# Altium schematic sheet Power_Board.SchDoc
size A; SheetNumber: 2; SheetTotal: 3
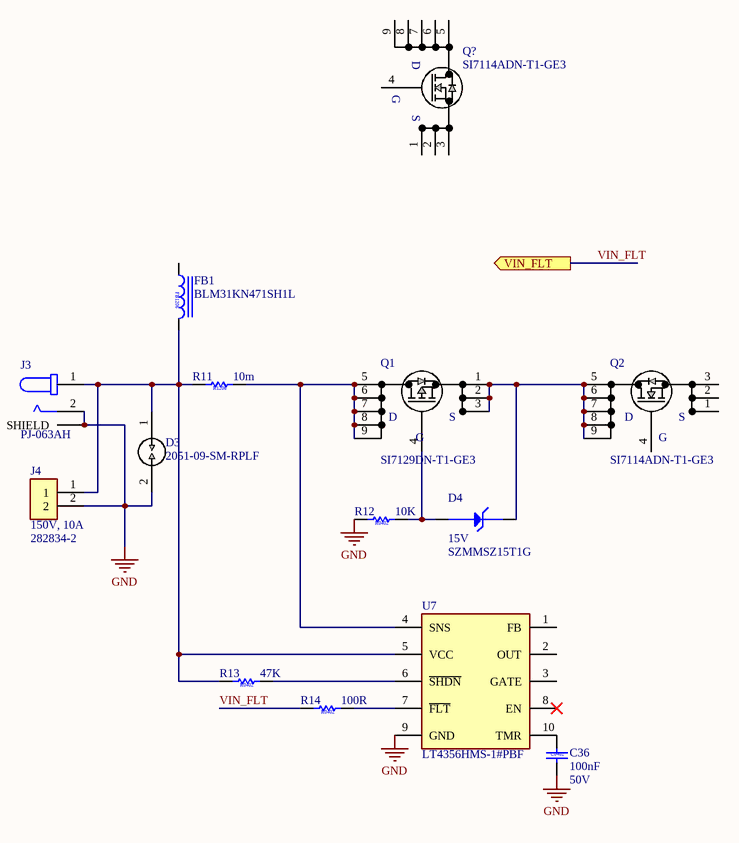
[diagram p0: Power_Board.SchDoc]

## Parts
C36  value 100nF  Voltage_Rating: 50V  [C0402]  (hidden comment: GRM155R71H104KE14D)
D3  2051-09-SM-RPLF  [DIO_GAS_205109SMRPLF]
D4  SZMMSZ15T1G  value 15V  [DIO_ZEN_SOD3716X135N]
FB1  BLM31KN471SH1L  [FB1206]
J3  PJ-063AH  [CON_CUI_PJ-063AH]
J4  282834-2  value 150V, 10A  [CON_TE_282834-2]
Q1  SI7129DN-T1-GE3  [MOS_POWERPACK-1212-8]
Q2  SI7114ADN-T1-GE3  [MOS_POWERPACK-1212-8]
Q?  SI7114ADN-T1-GE3  [MOS_POWERPACK-1212-8]
R11  value 10m  [R1206]  (hidden comment: PA1206FRE470R01Z)
R12  value 10K  [R0402]  (hidden comment: RC0402FR-0710KL)
R13  value 47K  [R0402]  (hidden comment: RC0402FR-0747KL)
R14  value 100R  [R0402]  (hidden comment: RC0402FR-07100RL)
U7  LT4356HMS-1#PBF  [SPD_SOP50P490X110-10N]

## Ports
VIN_FLT (out)

## Nets
GND: C36.1 D3.2 J3.2 J3.S1(SHIELD) J3.S2(SHIELD) J4.2 R12.1 U7.9(GND)
VIN_FLT: R14.1 ; port VIN_FLT
NetC36_2: C36.2 U7.10(TMR)
NetD3_1: D3.1 FB1.2 J3.1 J4.1 R11.1 R13.1 U7.5(VCC)
NetD4_1: D4.1(IO1) Q1.1(S) Q1.2(S) Q1.3(S) Q2.5(D) Q2.6(D) Q2.7(D) Q2.8(D) Q2.9(D)
NetD4_2: D4.2(GND) Q1.4(G) R12.2
NetQ1_5: Q1.5(D) Q1.6(D) Q1.7(D) Q1.8(D) Q1.9(D) R11.2 U7.4(SNS)
NetR13_2: R13.2 U7.6(~{SHDN})
NetR14_2: R14.2 U7.7(~{FLT})

Not connected (* = marked no-connect by the designer): FB1 1; Q2 1(S) 2(S) 3(S) 4(G); Q? 1(S) 2(S) 3(S) 4(G) 5(D) 6(D) 7(D) 8(D) 9(D); U7 1(FB) 2(OUT) 3(GATE) 8(EN)*

## Notes on the sheet
- (in symbol IND-203) FB1206

## Library data of the parts
C36 = CAP-104: Capacitor, MLCC, 100nF, 50V, X7R, 10%, 0402, T=0.5mm; Manufacturer: MURATA; Catalog_Number: 821614902; Part_Type: Capacitor; Manufacturer_Part_Number: GRM155R71H104KE14D; Package: C0402; ComponentLink1Description: Datasheet; ComponentLink1URL: http://tunmcdsvn.tun.st.com/Component_Datasheet_Library/Trunk/Capacitors/Murata_Capacitor_GR_series; Price(ILS): 0.1
D3 = DIO-201: Gas Discharge Tube, 90V DC Sparkover, 2kA Peak Pulse Current; Manufacturer: Bourns; Part_Type: Diode; Catalog_Number: 821200342; Datasheet Link: https://datasheet.datasheetarchive.com/originals/distributors/Datasheets-DGA18/380742.pdf; Manufacturer_Part_Number: 2051-09-SM-RPLF; Mouser Part Number: 652-2051-09-SM-RPLF; Mouser Price/Stock: https://www.mouser.co.uk/ProductDetail/Bourns/2051-09-SM-RPLF?qs=oyIm%2F3giSj7NHFY1d4mMJA%3D%3D; Arrow Part Number: 2051-09-SM-RPLF; Arrow Price/Stock: https://www.arrow.com/en/products/2051-09-sm-rplf/bourns?region=nac; Price(ILS): 3.08
D4 = DIO-001: Diode, Zener, 15V, 500mW, Low Current for Voltage Regulator; Manufacturer: onsemi; Catalog_Number: 821615283; Datasheet Link: chrome-extension://efaidnbmnnnibpcajpcglclefindmkaj/https://www.mouser.co.il/datasheet/2/308/1/MMSZ2V4T1_D-2316151.pdf; Manufacturer_Part_Number: SZMMSZ15T1G; Mouser Part Number: 863-SZMMSZ15T1G; Mouser Price/Stock: https://www.mouser.co.il/ProductDetail/onsemi/SZMMSZ15T1G?qs=PJJcWtbOkNXOKlSj9GlfUQ%3D%3D; Part_Type: Diode; Price(ILS): 1.72
FB1 = IND-203: Ferrite bead, 470R@100MHz, 4A, 20mOhm DCR, 25%, 1206; Manufacturer: MURATA; Catalog_Number: 821614210; Mouser Part Number: 81-BLM31KN471SH1L; Mouser Price/Stock: https://www.mouser.co.il/ProductDetail/Murata-Electronics/BLM31KN471SH1L?qs=EU6FO9ffTwc7C8y3YWE9tQ%3D%3D; Manufacturer_Part_Number: BLM31KN471SH1L; Datasheet Link: https://www.mouser.co.il/datasheet/2/281/QNFA9148-1915696.pdf; Part_Type: Ferrite bead; Value: 470R@100MHz; Price(ILS): 0.3
J3 = CON-005: Connector, Power Barrel Connector Jack, 2.10mm ID (0.083"), 5.50mm OD (0.217"), 24V, 8A, Through Hole, Right Angle; Manufacturer: CUI Devices; Catalog_Number: 821615011; Mouser Price/Stock: https://www.mouser.co.il/ProductDetail/CUI-Devices/PJ-063AH?qs=WyjlAZoYn51bQfA53nMcVA%3D%3D; Mouser Part Number: 490-PJ-063AH; Datasheet Link: https://www.cuidevices.com/product/product-resources/pj-063ah.pdf; Voltage Rating: 24V; Current Rating: 8A; Part_Type: Connector; Manufacturer_Part_Number: PJ-063AH; Price(ILS): 5.58
J4 = CON-201: Connector, Fixed Terminal Block, 2 Position, 2.54mm, .100" pitch, Through All, 150V, 10A, 16-30 AWG, Screw Connection; Manufacturer: TE Connectivity; Catalog_Number: 821615402; Datasheet Link: https://www.te.com/commerce/DocumentDelivery/DDEController?Action=showdoc&DocId=Catalog+Section%7F1308389_EUROSTYLE_TERMINAL_BLOCKS%7F0607%7Fpdf%7FEnglish%7FENG_CS_1308389_EUROSTYLE_TERMINAL_BLOCKS_0607.pdf%7F282834-2; Manufacturer_Part_Number: 282834-2; Mouser Part Number: 571-282834-2; Mouser Price/Stock: https://www.mouser.co.il/ProductDetail/TE-Connectivity/282834-2?qs=A%252Bip%252BNCYi6N8cVKuk8xDog%3D%3D; Part_Type: Connector; Price(ILS): 4.59
Q1 = TRA-002: MOSFET P-Channel, 1.5-2.8V Vth, 35A, 20mOhm Rds, -30V Vds, -20V Vgs, PowerPAK 1212-8; Manufacturer: Vishay; Catalog_Number: 821603170; Datasheet Link: https://www.vishay.com/docs/68966/si7129dn.pdf; Manufacturer_Part_Number: SI7129DN-T1-GE3; Mouser Part Number: 781-SI7129DN-GE3; Mouser Price/Stock: https://www.mouser.co.il/ProductDetail/Vishay-Semiconductors/SI7129DN-T1-GE3?qs=LWWr1WFOkdGr29jiBIQirw%3D%3D; Arrow Part Number: SI7129DN-T1-GE3; Arrow Price/Stock: https://www.arrow.com/en/products/si7129dn-t1-ge3/vishay?region=nac; Part_Type: MOSFET; Price(ILS): 3.36
Q2 Q? = TRA-001: MOSFET N-Channel, 1.2-2.5V Vth, 35A, 9.8mOhm Rds, 30V Vds, 20V Vgs, PowerPAK 1212-8; Manufacturer: Vishay; Catalog_Number: 821603234; Datasheet Link: https://www.vishay.com/docs/68932/si7114ad.pdf; Manufacturer_Part_Number: SI7114ADN-T1-GE3; Mouser Part Number: 781-SI7114ADN-T1-GE3; Mouser Price/Stock: https://www.mouser.co.il/ProductDetail/Vishay-Semiconductors/SI7114ADN-T1-GE3?qs=cPOO8qjhL6Mzxqw2gJeXWA%3D%3D; Arrow Part Number: SI7114DAN-T1-GE3; Arrow Price/Stock: https://www.arrow.com/en/products/si7114adn-t1-ge3/vishay?region=nac; Part_Type: MOSFET; Price(ILS): 3.73
R11 = RES-401: Resistor,10m,1206,1%,1W; Manufacturer: YAGEO; Alternate_Part_Number: WSLP1206R0100FEA; Alternate_Manufacturer: Vishay; Catalog_Number: 821615240; Part_Type: Resistor; Manufacturer_Part_Number: PA1206FRE470R01Z; Package: R1206; ComponentLink1Description: Datasheet; ComponentLink1URL: http://tunmcdsvn.tun.st.com/Component_Datasheet_Library/Trunk/Resistors/Yageo_Resistor_RC0402-series; Price(ILS): 0.1
R12 = RES-007: Resistor,10K,0402,1%,1/16W; Manufacturer: YAGEO; Catalog_Number: 800746930; Part_Type: Resistor; Manufacturer_Part_Number: RC0402FR-0710KL; Package: R0402; ComponentLink1Description: Datasheet; ComponentLink1URL: http://tunmcdsvn.tun.st.com/Component_Datasheet_Library/Trunk/Resistors/Yageo_Resistor_RC0402-series; Price(ILS): 0.1
R13 = RES-011: Resistor,47K,0402,1%,1/16W; Manufacturer: YAGEO; Catalog_Number: 821615186; Manufacturer_Part_Number: RC0402FR-0747KL; ComponentLink1Description: Datasheet; Part_Type: Resistor; Package: R0402; ComponentLink1URL: http://tunmcdsvn.tun.st.com/Component_Datasheet_Library/Trunk/Resistors/Yageo_Resistor_RC0402-series; Price(ILS): 0.1
R14 = RES-106: Resistor,100R,0402,1%,1/16W; Manufacturer: YAGEO; Catalog_Number: 988943207; Provided_By: SUBCO; Part_Type: Resistor; Manufacturer_Part_Number: RC0402FR-07100RL; ComponentLink1Description: Datasheet; Package: R0402; ComponentLink1URL: http://tunmcdsvn.tun.st.com/Component_Datasheet_Library/Trunk/Resistors/Yageo_Resistor_RC0402-series; Price(ILS): 0.1
U7 = ICS-112: SPD, Surge Suppressor, 4 VDC to 80 VDC, 40 uA; Manufacturer: Analog Devices; Catalog_Number: 821615429; Datasheet Link: chrome-extension://efaidnbmnnnibpcajpcglclefindmkaj/https://www.mouser.co.il/datasheet/2/609/LT4356_1_4356_2-1269492.pdf; Manufacturer_Part_Number: LT4356HMS-1#PBF; Mouser Part Number: 584-LT4356HMS-1#PBF; Mouser Price/Stock: https://www.mouser.co.il/ProductDetail/Analog-Devices/LT4356HMS-1PBF?qs=hVkxg5c3xu8TVCfpfkiVjw%3D%3D; Arrow Part Number: LT4356HMS-1#PBF; Arrow Price/Stock: https://www.arrow.com/en/products/lt4356hms-1pbf/analog-devices; Part_Type: SPD; Price(ILS): 36.33